# Altium project PCB_3U_SMA.PrjPCB
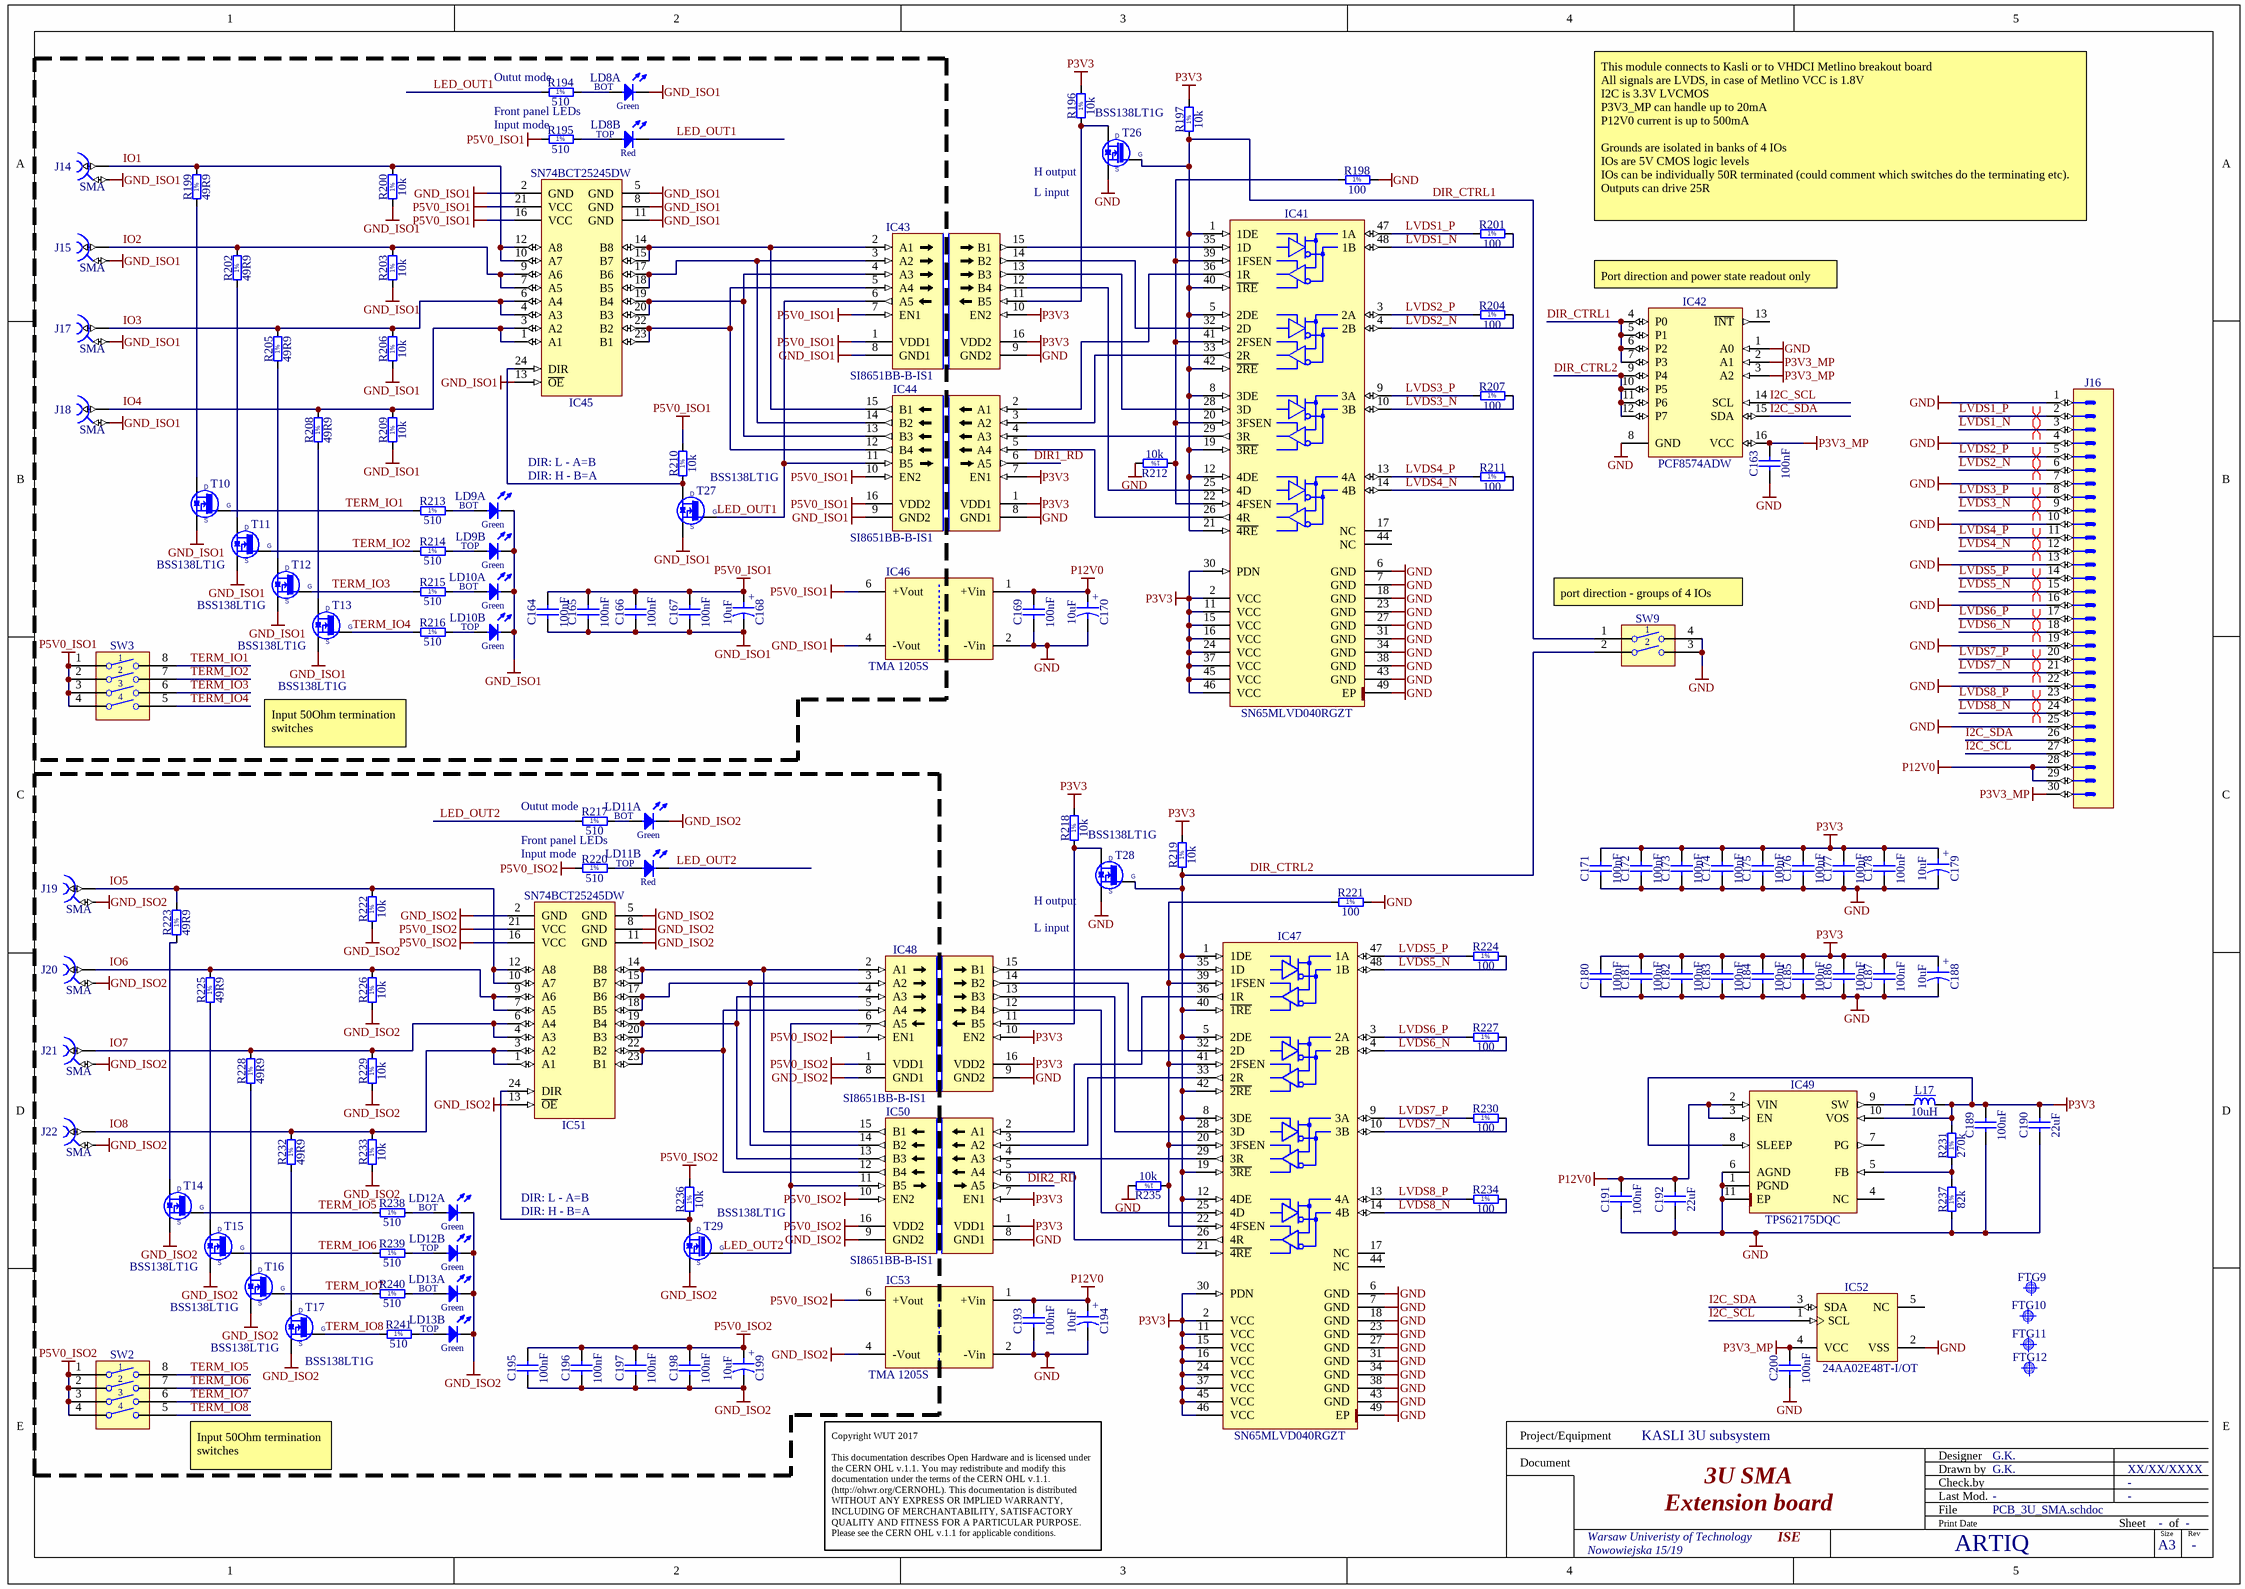
[diagram p0: PCB_3U_SMA.schdoc]
1 sheet, 134 parts. Net scope: global (net labels, ports and power ports of the same name join across sheets).
Board file: PCB_3U_SMA.PCBDOC

## Sheet PCB_3U_SMA.schdoc: 3U SMA
size 420 x 297 mm; Author: G.K.; CompanyName: WUT; DrawnBy: G.K.; Organization: WUT ISE; Address1: Warsaw Univeristy of Technology; Address2: Nowowiejska 15/19; Revision: -; SheetNumber: -; SheetTotal: -; EDA_Number: ARTIQ; Projet: KASLI 3U subsystem; ModifiedBy: -; CreateDate: XX/XX/XXXX; CheckedDate: -; Title2: Extension board; DivGrp: ISE; Designer: G.K.; ModifiedDate: -; ProjectName: KASLI 3U subsystem

### Parts
C163  100nF  [CAPC1005X55N]
C164  100nF  [CAPC1005X55N]
C165  100nF  [CAPC1005X55N]
C166  100nF  [CAPC1005X55N]
C167  100nF  [CAPC1005X55N]
C168  10uF  [CAPAE430X540N]
C169  100nF  [CAPC1005X55N]
C170  10uF  [CAPAE430X540N]
C171  100nF  [CAPC1005X55N]
C172  100nF  [CAPC1005X55N]
C173  100nF  [CAPC1005X55N]
C174  100nF  [CAPC1005X55N]
C175  100nF  [CAPC1005X55N]
C176  100nF  [CAPC1005X55N]
C177  100nF  [CAPC1005X55N]
C178  100nF  [CAPC1005X55N]
C179  10uF  [CAPAE430X540N]
C180  100nF  [CAPC1005X55N]
C181  100nF  [CAPC1005X55N]
C182  100nF  [CAPC1005X55N]
C183  100nF  [CAPC1005X55N]
C184  100nF  [CAPC1005X55N]
C185  100nF  [CAPC1005X55N]
C186  100nF  [CAPC1005X55N]
C187  100nF  [CAPC1005X55N]
C188  10uF  [CAPAE430X540N]
C189  100nF  [CAPC1005X55N]
C190  22uF  [CAPC2012X135N]
C191  100nF  [CAPC1005X55N]
C192  22uF  [CAPC2012X135N]
C193  100nF  [CAPC1005X55N]
C194  10uF  [CAPAE430X540N]
C195  100nF  [CAPC1005X55N]
C196  100nF  [CAPC1005X55N]
C197  100nF  [CAPC1005X55N]
C198  100nF  [CAPC1005X55N]
C199  10uF  [CAPAE430X540N]
C200  100nF  [CAPC1005X55N]
FTG9  Use only in PCB  [FIDUCIAL_TOP_C100-200]  (value not drawn)
FTG10  Use only in PCB  [FIDUCIAL_TOP_S100-200]  (value not drawn)
FTG11  Use only in PCB  [FIDUCIAL_TOP_S200-400]  (value not drawn)
FTG12  Use only in PCB  [FIDUCIAL_TOP_S100-200]  (value not drawn)
IC41  SN65MLVD040RGZT  [QFN50P700X700X100-49N-S420]
IC42  PCF8574ADW  [SOIC127P1030X265-16N]
IC43  SI8651BB-B-IS1  [SOIC127P600X175-16N]
IC44  SI8651BB-B-IS1  [SOIC127P600X175-16N]
IC45  SN74BCT25245DW  [SOIC127P1030X265-24N]
IC46  TMA 1205S  [DCDC_TRACO_TMA]
IC47  SN65MLVD040RGZT  [QFN50P700X700X100-49N-S420]
IC48  SI8651BB-B-IS1  [SOIC127P600X175-16N]
IC49  TPS62175DQC  [SON50P200X300X80-11N-R94X250]
IC50  SI8651BB-B-IS1  [SOIC127P600X175-16N]
IC51  SN74BCT25245DW  [SOIC127P1030X265-24N]
IC52  24AA02E48T-I/OT  [SOT95P280X145-5N]
IC53  TMA 1205S  [DCDC_TRACO_TMA]
J14  SMA  [MOLEX_73251-2120]
J15  SMA  [SMA209F]
J16  (no value)  [3M_N2530-6002RB]
J17  SMA  [MOLEX_73251-2120]
J18  SMA  [SMA209F]
J19  SMA  [MOLEX_73251-2120]
J20  SMA  [SMA209F]
J21  SMA  [MOLEX_73251-2120]
J22  SMA  [SMA209F]
L17  10uH  [IND_MURATA-PS_8400]
LD8  Red/Green  [LED_DIALIGHT_571-0112F]  (value not drawn)  (parts A,B of 2)
LD9  Green/Green  [LED_DIALIGHT_571-0122F]  (value not drawn)  (parts A,B of 2)
LD10  Green/Green  [LED_DIALIGHT_571-0122F]  (value not drawn)  (parts A,B of 2)
LD11  Red/Green  [LED_DIALIGHT_571-0112F]  (value not drawn)  (parts A,B of 2)
LD12  Green/Green  [LED_DIALIGHT_571-0122F]  (value not drawn)  (parts A,B of 2)
LD13  Green/Green  [LED_DIALIGHT_571-0122F]  (value not drawn)  (parts A,B of 2)
R194  510  [RESC1005X40N]
R195  510  [RESC1005X40N]
R196  10k  [RESC1005X40N]
R197  10k  [RESC1005X40N]
R198  100  [RESC1005X40N]
R199  49R9  [RESC3225X70N]
R200  10k  [RESC1005X40N]
R201  100  [RESC1005X40N]
R202  49R9  [RESC3225X70N]
R203  10k  [RESC1005X40N]
R204  100  [RESC1005X40N]
R205  49R9  [RESC3225X70N]
R206  10k  [RESC1005X40N]
R207  100  [RESC1005X40N]
R208  49R9  [RESC3225X70N]
R209  10k  [RESC1005X40N]
R210  10k  [RESC1005X40N]
R211  100  [RESC1005X40N]
R212  10k  [RESC1005X40N]
R213  510  [RESC1005X40N]
R214  510  [RESC1005X40N]
R215  510  [RESC1005X40N]
R216  510  [RESC1005X40N]
R217  510  [RESC1005X40N]
R218  10k  [RESC1005X40N]
R219  10k  [RESC1005X40N]
R220  510  [RESC1005X40N]
R221  100  [RESC1005X40N]
R222  10k  [RESC1005X40N]
R223  49R9  [RESC3225X70N]
R224  100  [RESC1005X40N]
R225  49R9  [RESC3225X70N]
R226  10k  [RESC1005X40N]
R227  100  [RESC1005X40N]
R228  49R9  [RESC3225X70N]
R229  10k  [RESC1005X40N]
R230  100  [RESC1005X40N]
R231  270k  [RESC1608X55N]
R232  49R9  [RESC3225X70N]
R233  10k  [RESC1005X40N]
R234  100  [RESC1005X40N]
R235  10k  [RESC1005X40N]
R236  10k  [RESC1005X40N]
R237  82k  [RESC1608X55N]
R238  510  [RESC1005X40N]
R239  510  [RESC1005X40N]
R240  510  [RESC1005X40N]
R241  510  [RESC1005X40N]
SW2  Switch  [SW_OMRON_A6S-4102-H]  (value not drawn)
SW3  Switch  [SW_OMRON_A6S-4102-H]  (value not drawn)
SW9  Switch  [SW_OMRON_A6S-2102-H]  (value not drawn)
T10  BSS138LT1G  [SOT95P240X110-3N]
T11  BSS138LT1G  [SOT95P240X110-3N]
T12  BSS138LT1G  [SOT95P240X110-3N]
T13  BSS138LT1G  [SOT95P240X110-3N]
T14  BSS138LT1G  [SOT95P240X110-3N]
T15  BSS138LT1G  [SOT95P240X110-3N]
T16  BSS138LT1G  [SOT95P240X110-3N]
T17  BSS138LT1G  [SOT95P240X110-3N]
T26  BSS138LT1G  [SOT95P240X110-3N]
T27  BSS138LT1G  [SOT95P240X110-3N]
T28  BSS138LT1G  [SOT95P240X110-3N]
T29  BSS138LT1G  [SOT95P240X110-3N]

### Nets
GND: C163.1 C169.1 C170.2 C171.1 C172.1 C173.1 C174.1 C175.1 C176.1 C177.1 C178.1 C179.2 C180.1 C181.1 C182.1 C183.1 C184.1 C185.1 C186.1 C187.1 C188.2 C189.1 C190.1 C191.1 C192.1 C193.1 C194.2 C200.1 IC41.6(GND) IC41.7(GND) IC41.18(GND) IC41.23(GND) IC41.27(GND) IC41.31(GND) IC41.34(GND) IC41.38(GND) IC41.43(GND) IC41.49(EP) IC42.1(A0) IC42.8(GND) IC43.9(GND2) IC44.8(GND1) IC46.2(-Vin) IC47.6(GND) IC47.7(GND) IC47.18(GND) IC47.23(GND) IC47.27(GND) IC47.31(GND) IC47.34(GND) IC47.38(GND) IC47.43(GND) IC47.49(EP) IC48.9(GND2) IC49.1(PGND) IC49.6(AGND) IC49.11(EP) IC50.8(GND1) IC52.2(VSS) IC53.2(-Vin) J16.1 J16.4 J16.7 J16.10 J16.13 J16.16 J16.19 J16.22 J16.25 R198.2 R212.2 R221.2 R235.2 R237.1 SW9.3 SW9.4 T26.2(S) T28.2(S)
GND_ISO1: C164.1 C165.1 C166.1 C167.1 C168.2 IC43.8(GND1) IC44.9(GND2) IC45.2(GND) IC45.5(GND) IC45.8(GND) IC45.11(GND) IC45.13(~{OE}) IC46.4(-Vout) J14.2 J15.2 J17.2 J18.2 LD8.1(C) LD9.1(C) LD9.3(C) LD10.1(C) LD10.3(C) R200.1 R203.1 R206.1 R209.1 T10.2(S) T11.2(S) T12.2(S) T13.2(S) T27.2(S)
GND_ISO2: C195.1 C196.1 C197.1 C198.1 C199.2 IC48.8(GND1) IC50.9(GND2) IC51.2(GND) IC51.5(GND) IC51.8(GND) IC51.11(GND) IC51.13(~{OE}) IC53.4(-Vout) J19.2 J20.2 J21.2 J22.2 LD11.1(C) LD12.1(C) LD12.3(C) LD13.1(C) LD13.3(C) R222.1 R226.1 R229.1 R233.1 T14.2(S) T15.2(S) T16.2(S) T17.2(S) T29.2(S)
P3V3: C171.2 C172.2 C173.2 C174.2 C175.2 C176.2 C177.2 C178.2 C179.1 C180.2 C181.2 C182.2 C183.2 C184.2 C185.2 C186.2 C187.2 C188.1 C189.2 C190.2 IC41.2(VCC) IC41.11(VCC) IC41.15(VCC) IC41.16(VCC) IC41.24(VCC) IC41.30(PDN) IC41.37(VCC) IC41.45(VCC) IC41.46(VCC) IC43.10(EN2) IC43.16(VDD2) IC44.1(VDD1) IC44.7(EN1) IC47.2(VCC) IC47.11(VCC) IC47.15(VCC) IC47.16(VCC) IC47.24(VCC) IC47.30(PDN) IC47.37(VCC) IC47.45(VCC) IC47.46(VCC) IC48.10(EN2) IC48.16(VDD2) IC49.8(SLEEP) IC49.10(VOS) IC50.1(VDD1) IC50.7(EN1) L17.2 R196.2 R197.2 R218.2 R219.2 R231.2
P3V3_MP: C163.2 C200.2 IC42.2(A1) IC42.3(A2) IC42.16(VCC) IC52.4(VCC) J16.30
P5V0_ISO1: C164.2 C165.2 C166.2 C167.2 C168.1 IC43.1(VDD1) IC43.7(EN1) IC44.10(EN2) IC44.16(VDD2) IC45.16(VCC) IC45.21(VCC) IC46.6(+Vout) R195.1 R210.2 SW3.1 SW3.2 SW3.3 SW3.4
P5V0_ISO2: C195.2 C196.2 C197.2 C198.2 C199.1 IC48.1(VDD1) IC48.7(EN1) IC50.10(EN2) IC50.16(VDD2) IC51.16(VCC) IC51.21(VCC) IC53.6(+Vout) R220.1 R236.2 SW2.1 SW2.2 SW2.3 SW2.4
P12V0: C169.2 C170.1 C191.2 C192.2 C193.2 C194.1 IC46.1(+Vin) IC49.2(VIN) IC49.3(EN) IC53.1(+Vin) J16.28 J16.29
DIR1_RD: IC44.6(A5)
DIR2_RD: IC50.6(A5)
DIR_CTRL1: IC41.1(1DE) IC41.5(2DE) IC41.8(3DE) IC41.12(4DE) IC41.19(~{3RE}) IC41.21(~{4RE}) IC41.40(~{1RE}) IC41.42(~{2RE}) IC42.4(P0) IC42.5(P1) IC42.6(P2) IC42.7(P3) R197.1 SW9.1 T26.1(G)
DIR_CTRL2: IC42.9(P4) IC42.10(P5) IC42.11(P6) IC42.12(P7) IC47.1(1DE) IC47.5(2DE) IC47.8(3DE) IC47.12(4DE) IC47.19(~{3RE}) IC47.21(~{4RE}) IC47.40(~{1RE}) IC47.42(~{2RE}) R219.1 SW9.2 T28.1(G)
I2C_SCL: IC42.14(SCL) IC52.1(SCL) J16.27
I2C_SDA: IC42.15(SDA) IC52.3(SDA) J16.26
IO1: IC45.10(A7) IC45.12(A8) J14.1 R199.2 R200.2
IO2: IC45.7(A5) IC45.9(A6) J15.1 R202.2 R203.2
IO3: IC45.4(A3) IC45.6(A4) J17.1 R205.2 R206.2
IO4: IC45.1(A1) IC45.3(A2) J18.1 R208.2 R209.2
IO5: IC51.10(A7) IC51.12(A8) J19.1 R222.2 R223.2
IO6: IC51.7(A5) IC51.9(A6) J20.1 R225.2 R226.2
IO7: IC51.4(A3) IC51.6(A4) J21.1 R228.2 R229.2
IO8: IC51.1(A1) IC51.3(A2) J22.1 R232.2 R233.2
LED_OUT1: IC43.6(A5) IC44.11(B5) LD8.3(C) R194.1 T27.1(G)
LED_OUT2: IC48.6(A5) IC50.11(B5) LD11.3(C) R217.1 T29.1(G)
LVDS1_N: IC41.48(1B) J16.3 R201.2
LVDS1_P: IC41.47(1A) J16.2 R201.1
LVDS2_N: IC41.4(2B) J16.6 R204.2
LVDS2_P: IC41.3(2A) J16.5 R204.1
LVDS3_N: IC41.10(3B) J16.9 R207.2
LVDS3_P: IC41.9(3A) J16.8 R207.1
LVDS4_N: IC41.14(4B) J16.12 R211.2
LVDS4_P: IC41.13(4A) J16.11 R211.1
LVDS5_N: IC47.48(1B) J16.15 R224.2
LVDS5_P: IC47.47(1A) J16.14 R224.1
LVDS6_N: IC47.4(2B) J16.18 R227.2
LVDS6_P: IC47.3(2A) J16.17 R227.1
LVDS7_N: IC47.10(3B) J16.21 R230.2
LVDS7_P: IC47.9(3A) J16.20 R230.1
LVDS8_N: IC47.14(4B) J16.24 R234.2
LVDS8_P: IC47.13(4A) J16.23 R234.1
TERM_IO1: R213.1 SW3.8 T10.1(G)
TERM_IO2: R214.1 SW3.7 T11.1(G)
TERM_IO3: R215.1 SW3.6 T12.1(G)
TERM_IO4: R216.1 SW3.5 T13.1(G)
TERM_IO5: R238.1 SW2.8 T14.1(G)
TERM_IO6: R239.1 SW2.7 T15.1(G)
TERM_IO7: R240.1 SW2.6 T16.1(G)
TERM_IO8: R241.1 SW2.5 T17.1(G)
NetIC41_20: IC41.20(3FSEN) IC41.22(4FSEN) IC41.39(1FSEN) IC41.41(2FSEN) R198.1 R212.1
NetIC41_25: IC41.25(4D) IC43.12(B4)
NetIC41_26: IC41.26(4R) IC44.5(A4)
NetIC41_28: IC41.28(3D) IC43.13(B3)
NetIC41_29: IC41.29(3R) IC44.4(A3)
NetIC41_32: IC41.32(2D) IC43.14(B2)
NetIC41_33: IC41.33(2R) IC44.3(A2)
NetIC41_35: IC41.35(1D) IC43.15(B1)
NetIC41_36: IC41.36(1R) IC44.2(A1)
NetIC43_2: IC43.2(A1) IC44.15(B1) IC45.14(B8) IC45.15(B7)
NetIC43_3: IC43.3(A2) IC44.14(B2) IC45.17(B6) IC45.18(B5)
NetIC43_4: IC43.4(A3) IC44.13(B3) IC45.19(B4) IC45.20(B3)
NetIC43_5: IC43.5(A4) IC44.12(B4) IC45.22(B2) IC45.23(B1)
NetIC43_11: IC43.11(B5) R196.1 T26.3(D)
NetIC45_24: IC45.24(DIR) R210.1 T27.3(D)
NetIC47_20: IC47.20(3FSEN) IC47.22(4FSEN) IC47.39(1FSEN) IC47.41(2FSEN) R221.1 R235.1
NetIC47_25: IC47.25(4D) IC48.12(B4)
NetIC47_26: IC47.26(4R) IC50.5(A4)
NetIC47_28: IC47.28(3D) IC48.13(B3)
NetIC47_29: IC47.29(3R) IC50.4(A3)
NetIC47_32: IC47.32(2D) IC48.14(B2)
NetIC47_33: IC47.33(2R) IC50.3(A2)
NetIC47_35: IC47.35(1D) IC48.15(B1)
NetIC47_36: IC47.36(1R) IC50.2(A1)
NetIC48_2: IC48.2(A1) IC50.15(B1) IC51.14(B8) IC51.15(B7)
NetIC48_3: IC48.3(A2) IC50.14(B2) IC51.17(B6) IC51.18(B5)
NetIC48_4: IC48.4(A3) IC50.13(B3) IC51.19(B4) IC51.20(B3)
NetIC48_5: IC48.5(A4) IC50.12(B4) IC51.22(B2) IC51.23(B1)
NetIC48_11: IC48.11(B5) R218.1 T28.3(D)
NetIC49_5: IC49.5(FB) R231.1 R237.2
NetIC49_9: IC49.9(SW) L17.1
NetIC51_24: IC51.24(DIR) R236.1 T29.3(D)
NetLD8_2: LD8.2(A) R194.2
NetLD8_4: LD8.4(A) R195.2
NetLD9_2: LD9.2(A) R213.2
NetLD9_4: LD9.4(A) R214.2
NetLD10_2: LD10.2(A) R215.2
NetLD10_4: LD10.4(A) R216.2
NetLD11_2: LD11.2(A) R217.2
NetLD11_4: LD11.4(A) R220.2
NetLD12_2: LD12.2(A) R238.2
NetLD12_4: LD12.4(A) R239.2
NetLD13_2: LD13.2(A) R240.2
NetLD13_4: LD13.4(A) R241.2
NetR199_1: R199.1 T10.3(D)
NetR202_1: R202.1 T11.3(D)
NetR205_1: R205.1 T12.3(D)
NetR208_1: R208.1 T13.3(D)
NetR223_1: R223.1 T14.3(D)
NetR225_1: R225.1 T15.3(D)
NetR228_1: R228.1 T16.3(D)
NetR232_1: R232.1 T17.3(D)

Not connected (* = marked no-connect by the designer): IC41 17(NC) 44(NC); IC42 13(~{INT}); IC47 17(NC) 44(NC); IC49 4(NC) 7(PG); IC52 5(NC)

### Layout directives
differential pair: LVDS1_N, LVDS1_P, LVDS2_N, LVDS2_P, LVDS3_N, LVDS3_P, LVDS4_N, LVDS4_P, LVDS5_N, LVDS5_P, LVDS6_N, LVDS6_P, LVDS7_N, LVDS7_P, LVDS8_N, LVDS8_P

### Notes on the sheet
- (near R195) Input mode
- (near R194) Outut mode
- Front panel LEDs
- (near T26) H output
- L input
- This module connects to Kasli or to VHDCI Metlino breakout board
  All signals are LVDS, in case of Metlino VCC is 1.8V
  I2C is 3.3V LVCMOS
  P3V3_MP can handle up to 20mA
  P12V0 current is up to 500mA
  Grounds are isolated in banks of 4 IOs
  IOs are 5V CMOS logic levels
  IOs can be individually 50R terminated (could comment which switches do the terminating etc).
  Outputs can drive 25R
- (near IC42) Port direction and power state readout only
- DIR: L - A=B
- (near LD9) DIR: H - B=A
- (near SW9) port direction - groups of 4 IOs
- Input 50Ohm termination switches
- (near R220) Input mode
- (near R217) Outut mode
- (near T28) H output
- DIR: H - B=A
- (near SW2) Input 50Ohm termination switches
- Copyright WUT 2017
  This documentation describes Open Hardware and is licensed under the CERN OHL v.1.1. You may redistribute and modify this documentation under the terms of the CERN OHL v.1.1. (http://ohwr.org/CERNOHL). This documentation is distributed WITHOUT ANY EXPRESS OR IMPLIED WARRANTY, INCLUDING OF MERCHANTABILITY, SATISFACTORY QUALITY AND FITNESS FOR A PARTICULAR PURPOSE. Please see the CERN OHL v.1.1 for applicable conditions.
- Project/Equipment
- Document
- Designer
- Drawn by
- Check.by
- File
- Last Mod.
- Print Date
- Sheet
- Size
- A3
- of
- Rev
- (in symbol CAE430-540_10UF_16V_20%) +
- (in symbol LED_DIALIGHT_571-0112F, part A) BOT; Green
- (in symbol LED_DIALIGHT_571-0112F, part B) TOP; Red
- (in symbol LED_DIALIGHT_571-0122F, part A) BOT; Green
- (in symbol LED_DIALIGHT_571-0122F, part B) TOP; Green
- (in symbol R0402_10K_1%_0.0625W_100PPM) 1%
- (in symbol R0402_100R_1%_0.1W_100PPM) 1%
- (in symbol R0402_510R_1%_0.0625W_100PPM) 1%
- (in symbol R0603_82K_1%_0.1W_100PPM) 1%
- (in symbol R0603_270K_1%_0.1W_100PPM) 1%
- (in symbol R1210_49R9_1%_0.5W_100PPM_VISHAY_CRCW) 1%

### Library data of the parts
C163-C167 C169 C171-C178 C180-C187 C189 C191 C193 C195-C198 C200 = CC0402_100NF_16V_10%_X5R: Non-polarised capacitor; Part Description: SMD Multilayer Chip Ceramic Capacitor; Manufacturer: GENERIC; Manufacturer1 Part Number: GRM155R61C104KA88D; Voltage: 16V; TC: X5R; Tolerance: ±10%; Part Number: CC0402_100NF_16V_10%_X5R; Component Kind: Standard; Component Type: Standard; Pin Count: 2; Value: 100nF; Status: None; Manufacturer Part Number: CC0402_100NF_16V_10%_X5R; Case: 0402; Mounted: Yes; Socket: No; SMD: Yes; Sense: No; Manufacturer1 Example: MURATA; Manufacturer1 ComponentHeight: 0.55mm; HelpURL: \\cern.ch\dfs\Applications\Altium\Datasheets\CC0402_X5R_MURATA_GRM.pdf; Author: CERN DEM JLC; CreateDate: 10.12.2013; LatestRevisionDate: 10.12.2013
C168 C170 C179 C188 C194 C199 = CAE430-540_10UF_16V_20%: Polarised capacitor; Part Description: Aluminum Electrolytic SMT Capacitor; Manufacturer: PANASONIC; Manufacturer Part Number: EEEFK1C100AR; Voltage: 16V; Tolerance: ±20%; Part Number: CAE430-540_10UF_16V_20%; Component Kind: Standard; Component Type: Standard; Pin Count: 2; Value: 10uF; Status: Not Recommended; Case: B; Mounted: Yes; Socket: No; SMD: Yes; Sense: No; ComponentHeight: 5.8mm; HelpURL: \\cern.ch\dfs\Applications\Altium\Datasheets\CAE_PANASONIC_FK.pdf; Author: CERN DEM JLC; CreateDate: 03.12.2007; LatestRevisionDate: 05.11.2014
C190 C192 = CC0805_22UF_16V_10%_X5R: Non-polarised capacitor; Part Description: SMD Multilayer Chip Ceramic Capacitor; Manufacturer: GENERIC; Manufacturer1 Part Number: C2012X5R1C226KT; Voltage: 16V; TC: X5R; Tolerance: ±10%; Part Number: CC0805_22UF_16V_10%_X5R; Component Kind: Standard; Component Type: Standard; Pin Count: 2; Value: 22uF; Status: Preferred; Manufacturer Part Number: CC0805_22UF_16V_10%_X5R; Case: 0805; Mounted: Yes; Socket: No; SMD: Yes; Sense: No; Manufacturer1 Example: TDK; Manufacturer1 ComponentHeight: 1.35mm; HelpURL: \\cern.ch\dfs\Applications\Altium\Datasheets\CC0805_X5R_TDK_C.pdf; Author: CERN DEM JLC; CreateDate: 25.10.2012; LatestRevisionDate: 25.10.2012
FTG9 = FIDUCIAL_TARGET_C100-200: Fiducial Target; Part Description: Round Fiducial Target, Top Layer, 1.0mm, Top Solder 2.0mm, Keepout =2.0mm; Mounted: No; Part Number: FIDUCIAL_TARGET_C100-200; Component Kind: Standard (No BOM); Component Type: Standard (No BOM); Pin Count: 1; Family: Fiducial; Socket: No; SMD: Yes; Sense: No; Status: None; ComponentHeight: 0mm; HelpURL: Undefined; Author: CERN DEM JLC; CreateDate: 09.02.2010; LatestRevisionDate: 04.04.2012; PackageDescription: Round Fiducial Target, Top Layer, 1.0mm, Top Solder 2.0mm, Keepout =2.0mm
FTG10 FTG12 = FIDUCIAL_TARGET_S100-200: Fiducial Target; Part Description: Square Fiducial Target, Top Layer, 1.0mm, Top Solder 2.0mm, Keepout =2.0mm; Mounted: No; Part Number: FIDUCIAL_TARGET_S100-200; Component Kind: Standard (No BOM); Component Type: Standard (No BOM); Pin Count: 1; Family: Fiducial; Socket: No; SMD: Yes; Sense: No; Status: None; ComponentHeight: 0mm; HelpURL: Undefined; Author: CERN DEM JLC; CreateDate: 09.02.2010; LatestRevisionDate: 04.04.2012; PackageDescription: Square Fiducial Target, Top Layer, 1.0mm, Top Solder 2.0mm, Keepout =2.0mm
FTG11 = FIDUCIAL_TARGET_S200-400: Fiducial Target; Part Description: Square Fiducial Target, Top Layer, 2.0mm, Top Solder 4.0mm, Keepout =4.0mm; Mounted: No; Part Number: FIDUCIAL_TARGET_S200-400; Component Kind: Standard (No BOM); Component Type: Standard (No BOM); Pin Count: 1; Family: Fiducial; Socket: No; SMD: Yes; Sense: No; Status: None; ComponentHeight: 0mm; HelpURL: Undefined; Author: CERN DEM JLC; CreateDate: 02.06.2008; LatestRevisionDate: 04.04.2012; PackageDescription: Square Fiducial Target, Top Layer, 2.0mm, Top Solder 4.0mm, Keepout =4.0mm
IC41 IC47 = SN65MLVD040RGZT: 4-Channel Half-Duplex M-LVDS Line Transceiver; Manufacturer: TEXAS INSTRUMENTS; PressFit: No; Bonding: No; Part Number: SN65MLVD040RGZT; Component Kind: Standard; Component Type: Standard; Device: SN65MLVD040RGZT; PackageDescription: QFN, 0.50mm Pitch, Square; 48 Pin, 7.00mm L X 7.00mm W X 1mm H body (W/Thermal Tab 4.2mm X 4.2mm), IPC Medium Density; Part Description: 4-Channel Half-Duplex M-LVDS Line Transceiver; Manufacturer Part Number: SN65MLVD040RGZT; Pin Count: 49; Case: QFN48; Mounted: Yes; Socket: No; SMD: Yes; Sense: No; ComponentHeight: 1mm; Author: CERN DEM JLC; HelpURL: \\cern.ch\dfs\Applications\Altium\Datasheets\SN65MLVD040RGZT.pdf; CreateDate: 17.03.2011; LatestRevisionDate: 17.03.2011
IC42 = PCF8574ADW: Remote 8-bit I/O Expander For I2C Bus; Manufacturer: TEXAS INSTRUMENTS; PressFit: No; Bonding: No; Part Number: PCF8574ADW; Component Kind: Standard; Component Type: Standard; Device: PCF8574ADW; PackageDescription: SOIC 16, Pitch 1.27mm - Body 7.5x10.3mm, IPC Medium Density; Part Description: Remote 8-bit I/O Expander For I2C Bus; Manufacturer Part Number: PCF8574ADW; Pin Count: 16; Case: SOIC16W; Mounted: Yes; Socket: No; SMD: Yes; Sense: No; ComponentHeight: 2.65mm; Author: CERN DEM JLC; HelpURL: \\cern.ch\dfs\Applications\Altium\Datasheets\PCF8574ADW.pdf; CreateDate: 01.11.2012; LatestRevisionDate: 01.11.2012
IC43 IC44 IC48 IC50 = SI8651BB-B-IS1: Low Power Five-Channel Digital Isolator; Part Description: 2.5kV 150Mbps Low Power Five-Channel Digital Isolator; Manufacturer: SILICON LABS; PressFit: No; Bonding: No; Part Number: SI8651BB-B-IS1; Component Kind: Standard; Component Type: Standard; Device: SI8651BB-B-IS1; PackageDescription: SOIC 16, Pitch 1.27mm - Body 4x10mm, IPC Medium Density; Manufacturer Part Number: SI8651BB-B-IS1; Pin Count: 16; Case: SOIC16; Mounted: Yes; Socket: No; SMD: Yes; Sense: No; ComponentHeight: 1.75mm; Author: CERN DEM JLC; HelpURL: \\cern.ch\dfs\Applications\Altium\Datasheets\SI8651BB-B-IS1.pdf; CreateDate: 31.10.2013; LatestRevisionDate: 31.10.2013
IC45 IC51 = SN74BCT25245DW: 25 Ohms Octal Bus Transceiver With 3-State Outputs; Manufacturer: TEXAS INSTRUMENTS; PressFit: No; Bonding: No; Part Number: SN74BCT25245DW; Component Kind: Standard; Component Type: Standard; Device: SN74BCT25245DW; PackageDescription: SOIC 24, Pitch 1.27mm - Body 7.6x15.6mm, IPC Medium Density; Part Description: 25 Ohms Octal Bus Transceiver With 3-State Outputs; Manufacturer Part Number: SN74BCT25245DW; Pin Count: 24; Case: SOIC24; Mounted: Yes; Socket: No; SMD: Yes; Sense: No; ComponentHeight: 2.65mm; Author: CERN DEM JLC; HelpURL: \\cern.ch\dfs\Applications\Altium\Datasheets\SN74BCT25245DW.pdf; CreateDate: 09.11.2009; LatestRevisionDate: 09.11.2009
IC46 IC53 = DC/DC_TRACO_TMA1205S: 1 W Watt, 10.8-13.2VDCVin, 5 V@0.2 A; Part Description: 12V ±10% to 5V, Iout (max) 200mA, 1W DC-DC Converter; Manufacturer: TRACO POWER; PressFit: No; Bonding: No; Part Number: TMA 1205S; Component Kind: Standard; Component Type: Standard; Device: TMA 1205S; PackageDescription: TMA Series, Body 19.5x6.1mm, SIP-6, Unregulated; Manufacturer Part Number: TMA 1205S; Pin Count: 4; Mounted: Yes; Socket: No; SMD: No; Sense: No; ComponentHeight: 10.45mm; HelpURL: \\cern.ch\dfs\Applications\Altium\Datasheets\TMA 0505S.pdf; Author: GK; CreateDate: 17.12.2016; LatestRevisionDate: 17.12.2016
IC49 = TPS62175DQC: 4.75-28VDC to 1-6VDC, 500mA Step-Down Converter With Sleep Mode; Manufacturer: TEXAS INSTRUMENTS; PressFit: No; Bonding: No; Part Number: TPS62175DQC; Component Kind: Standard; Component Type: Standard; Device: TPS62175DQC; PackageDescription: SON, 10-Leads, Body 2x3mm, Pitch 0.5mm, Thermal Pad 0.94x2.5mm, IPC Medium Density; Part Description: 4.75-28VDC to 1-6VDC, 500mA Step-Down Converter With Sleep Mode; Manufacturer Part Number: TPS62175DQC; Pin Count: 11; Case: SON10; Mounted: Yes; Socket: No; SMD: Yes; Sense: No; ComponentHeight: 0.8mm; HelpURL: \\cern.ch\dfs\Applications\Altium\Datasheets\TPS62175DQC.pdf; Author: CERN DEM JMW; CreateDate: 11.08.2015; LatestRevisionDate: 11.08.2015
IC52 = 24AA02E48T-I/OT: 1.7V-5.5V, 2K I2C Serial EEPROM With EUI-48 Node Identity; Manufacturer: MICROCHIP TECHNOLOGY; PressFit: No; Bonding: No; Part Number: 24AA02E48T-I/OT; Component Kind: Standard; Component Type: Standard; Device: 24AA02E48T-I/OT; PackageDescription: SOT, 0.95mm pitch; 5 pin, 1.60mm W X 2.90mm L X 1.45mm H body, IPC Medium Density; Part Description: 1.7V-5.5V, 2K I2C Serial EEPROM With EUI-48 Node Identity; Manufacturer Part Number: 24AA02E48T-I/OT; Pin Count: 5; Case: SOT23-5; Mounted: Yes; Socket: No; SMD: Yes; Sense: No; ComponentHeight: 1.45mm; HelpURL: \\cern.ch\dfs\Applications\Altium\Datasheets\24AA02E48T-I-OT.pdf; Author: CERN DEM MR; CreateDate: 31.03.2016; LatestRevisionDate: 31.03.2016
J14 J17 J19 J21 = CON_SMA_RA_SMD_73251-2120: 50 Ohm, SMA Edge Mount PCB, With Jam Nut And Lock Washer; Manufacturer: MOLEX; PressFit: No; Part Number: MOLEX_73251-2120; Component Kind: Standard; Component Type: Standard; Pin Count: 5; Family: SMA; Mounted: Yes; Socket: No; SMD: Yes; Sense: No; Status: None; Part Description: 50 Ohm, SMA Edge Mount PCB, With Jam Nut And Lock Washer; Manufacturer Part Number: 73251-2120; ComponentHeight: 5.75mm; HelpURL: \\cern.ch\dfs\Applications\Altium\Datasheets\MOLEX_73251-2121.pdf; Author: CERN DEM JLC; CreateDate: 26.10.2016; LatestRevisionDate: 26.10.2016
J15 J18 J20 J22 = CON_SMA_SMA209F: 50 Ohm Through Hole SMA Right Angle PCB Jack; Manufacturer: S-Conn; Manufacturer Part Number: S209F4G02-1; PressFit: No; Part Number: SMA209F; Component Kind: Standard; Component Type: Standard; Pin Count: 5; Family: SMA; Mounted: Yes; Socket: No; SMD: No; Sense: No; Status: None; Part Description: 50 Ohm Through Hole SMA Right Angle PCB Jack; ComponentHeight: 10.44mm; HelpURL: \\cern.ch\dfs\Applications\Altium\Datasheets\AMPHENOL_132203.pdf; Author: GK; CreateDate: 06.10.2016; LatestRevisionDate: 06.10.2016
J16 = 3M_N2530-6002RB: Connector 30 Male; Part Description: 30 Contacts - Straight .100'' x .100'' Low Profile Four-Wall Header, 2500 Series; Manufacturer: 3M; PressFit: No; Part Number: 3M_N2530-6002RB; Component Kind: Standard; Component Type: Standard; Pin Count: 30; Family: Header 30; Mounted: Yes; Socket: No; SMD: No; Sense: No; Status: None; Manufacturer Part Number: N2530-6002RB; ComponentHeight: 10.03mm; HelpURL: \\cern.ch\dfs\Applications\Altium\Datasheets\3M_N2530-6002RB.pdf; Author: CERN DEM JLC; CreateDate: 11.02.2009; LatestRevisionDate: 11.08.2009
L17 = IND_10UH_10%_MURATA-PS_8400: Inductor With Core; Part Description: Miniature Surface Mount Power Inductor (8400 Serie); Manufacturer: MURATA POWER SOLUTIONS; Manufacturer Part Number: 84103C; Power: 950mA; Resistance: 0.24R; Tolerance: ±10%; Part Number: IND_10UH_10%_MURATA-PS_8400; Component Kind: Standard; Component Type: Standard; Pin Count: 2; Value: 10uH; Status: None; Mounted: Yes; Socket: No; SMD: Yes; Sense: No; ComponentHeight: 2.9mm; HelpURL: \\cern.ch\dfs\Applications\Altium\Datasheets\IND_MURATA-PS_8400.pdf; Author: CERN DEM JLC; CreateDate: 02.07.2012; LatestRevisionDate: 02.07.2012
LD8 LD11 = LED_DIALIGHT_571-0112F: 2x LED  Botom Green, Top Red; Part Description: Dual 2mm  LEDs, Red Top,Green Bot, CBI® Circuit Board Indicator (Without positioning pins); PressFit: No; Bonding: No; Part Number: LED_DIALIGHT_571-0112F; Component Kind: Standard; Component Type: Standard; Color: Red/Green; PackageDescription: 2x 2mm LED (Top: Red, Bot: Green) PCB Edge Mounting (Without positioning pins) DIALIGHT 571 Serie; Manufacturer: DIALIGHT; Manufacturer Part Number: 571-0112F; Pin Count: 4; Mounted: Yes; Socket: No; SMD: No; Sense: No; ComponentHeight: 8.6mm; HelpURL: \\cern.ch\dfs\Applications\Altium\Datasheets\LED_DIALIGHT_571-0112F.pdf; Author: CERN DEM JLC; CreateDate: 09.11.2009; LatestRevisionDate: 17.03.2010
LD9 LD10 LD12 LD13 = LED_DIALIGHT_571-0122F: LED x2 Green 1C2A-BOT_3C4A-TOP; Part Description: Dual 2mm Green LEDs CBI® Circuit Board Indicator (Without positioning pins); PressFit: No; Bonding: No; Part Number: LED_DIALIGHT_571-0122F; Component Kind: Standard; Component Type: Standard; Color: Green/Green; PackageDescription: 2x 2mm Red LED PCB Edge Mounting (Without positioning pins) DIALIGHT 571 Serie; Manufacturer: DIALIGHT; Manufacturer Part Number: 571-0122F; Pin Count: 4; Mounted: Yes; Socket: No; SMD: No; Sense: No; ComponentHeight: 8.6mm; HelpURL: \\cern.ch\dfs\Applications\Altium\Datasheets\LED_DIALIGHT_571-0122F.pdf; Author: CERN DEM JLC; CreateDate: 09.11.2009; LatestRevisionDate: 17.03.2010
R194 R195 R213-R217 R220 R238-R241 = R0402_510R_1%_0.0625W_100PPM: Resistor - 1%; Part Description: General Purpose Thick Film Chip Resistor; Manufacturer: GENERIC; Manufacturer1 Part Number: 232270675101L; TC: ±100ppm/°C; Part Number: R0402_510R_1%_0.0625W_100PPM; Component Kind: Standard; Component Type: Standard; Pin Count: 2; Value: 510; Status: Not recommended; Power: 0.0625W; Tolerance: ±1%; Manufacturer Part Number: R0402_510R_1%_0.0625W_100PPM; Case: 0402; Mounted: Yes; Sense: No; Socket: No; SMD: Yes; Manufacturer1 Example: YAGEO PHYCOMP; Manufacturer1 ComponentHeight: 0.4mm; HelpURL: \\cern.ch\dfs\Applications\Altium\Datasheets\R0402_Phycomp_RC0402.pdf; Author: CERN DEM JLC; CreateDate: 03.12.2007; LatestRevisionDate: 17.10.2012
R196 R197 R200 R203 R206 R209 R210 R212 R218 R219 R222 R226 R229 R233 R235 R236 = R0402_10K_1%_0.0625W_100PPM: Resistor - 1%; Part Description: General Purpose Thick Film Chip Resistor; Manufacturer: GENERIC; Manufacturer1 Part Number: 232270671003L; TC: ±100ppm/°C; Part Number: R0402_10K_1%_0.0625W_100PPM; Component Kind: Standard; Component Type: Standard; Pin Count: 2; Value: 10k; Status: Not recommended; Power: 0.0625W; Tolerance: ±1%; Manufacturer Part Number: R0402_10K_1%_0.0625W_100PPM; Case: 0402; Mounted: Yes; Sense: No; Socket: No; SMD: Yes; Manufacturer1 Example: YAGEO PHYCOMP; Manufacturer1 ComponentHeight: 0.4mm; HelpURL: \\cern.ch\dfs\Applications\Altium\Datasheets\R0402_Phycomp_RC0402.pdf; Author: CERN DEM JLC; CreateDate: 03.12.2007; LatestRevisionDate: 17.10.2012
R198 R201 R204 R207 R211 R221 R224 R227 R230 R234 = R0402_100R_1%_0.1W_100PPM: Resistor - 1%; Part Description: General Purpose Thick Film Chip Resistor; Manufacturer: GENERIC; Manufacturer Part Number: R0402_100R_1%_0.1W_100PPM_50V; Manufacturer1 Part Number: ERJ2RKF1000X; Power: 0.1W; TC: ±100ppm/°C; Voltage: 50V; Part Number: R0402_100R_1%_0.1W_100PPM; Component Kind: Standard; Component Type: Standard; Pin Count: 2; Value: 100; Status: Not recommended; Tolerance: ±1%; Case: 0402; Mounted: Yes; Sense: No; Socket: No; SMD: Yes; Manufacturer1 Example: PANASONIC; Manufacturer1 ComponentHeight: 0.4mm; HelpURL: \\cern.ch\dfs\Applications\Altium\Datasheets\R0402_PANASONIC_ERJ2RK.pdf; Author: CERN DEM JLC; CreateDate: 12.12.2013; LatestRevisionDate: 03.03.2015
R199 R202 R205 R208 R223 R225 R228 R232 = R1210_49R9_1%_0.5W_100PPM_VISHAY_CRCW: Resistor - 1%; Part Description: Thick Film Chip Resistor; Manufacturer: VISHAY DRALORIC; Manufacturer Part Number: CRCW121049R9FKTA; Power: 0.5W; TC: ±100ppm/°C; Part Number: R1210_49R9_1%_0.5W_100PPM_VISHAY_CRCW; Component Kind: Standard; Component Type: Standard; Pin Count: 2; Value: 49R9; Status: None; Tolerance: ±1%; Case: 1210; Mounted: Yes; Sense: No; Socket: No; SMD: Yes; ComponentHeight: 0.6mm; HelpURL: \\cern.ch\dfs\Applications\Altium\Datasheets\R1210_VISHAY_CRCW1210.pdf; Author: CERN DEM JMW; CreateDate: 06.08.2014; LatestRevisionDate: 06.08.2014
R231 = R0603_270K_1%_0.1W_100PPM: Resistor - 1%; Part Description: General Purpose Thick Film Chip Resistor; Manufacturer: GENERIC; Manufacturer1 Part Number: NRC06F2703TRF; Power: 0.1W; TC: ±100ppm/°C; Part Number: R0603_270K_1%_0.1W_100PPM; Component Kind: Standard; Component Type: Standard; Pin Count: 2; Value: 270k; Status: Preferred; Tolerance: ±1%; Manufacturer Part Number: R0603_270K_1%_0.1W_100PPM; Case: 0603; Mounted: Yes; Sense: No; Socket: No; SMD: Yes; Manufacturer1 Example: NIC COMPONENT; Manufacturer1 ComponentHeight: 0.55mm; HelpURL: \\cern.ch\dfs\Applications\Altium\Datasheets\R0603_NIC_NRC.pdf; Author: CERN DEM JLC; CreateDate: 03.12.2007; LatestRevisionDate: 13.03.2008
R237 = R0603_82K_1%_0.1W_100PPM: Resistor - 1%; Part Description: General Purpose Thick Film Chip Resistor; Manufacturer: GENERIC; Manufacturer1 Part Number: NRC06F8202TRF; Power: 0.1W; TC: ±100ppm/°C; Part Number: R0603_82K_1%_0.1W_100PPM; Component Kind: Standard; Component Type: Standard; Pin Count: 2; Value: 82k; Status: Preferred; Tolerance: ±1%; Manufacturer Part Number: R0603_82K_1%_0.1W_100PPM; Case: 0603; Mounted: Yes; Sense: No; Socket: No; SMD: Yes; Manufacturer1 Example: NIC COMPONENT; Manufacturer1 ComponentHeight: 0.55mm; HelpURL: \\cern.ch\dfs\Applications\Altium\Datasheets\R0603_NIC_NRC.pdf; Author: CERN DEM JLC; CreateDate: 03.12.2007; LatestRevisionDate: 13.03.2008
SW2 SW3 = SW_OMRON_A6S-4102-H: 4 Ways SPST DIP Switch; Part Description: 4 Ways SPST DIP Switch, White Flat Actuator with Seal Tape, Contact Rating 25mA 24VDC; Manufacturer: OMRON; PressFit: No; Part Number: SW_OMRON_A6S-4102-H; Component Kind: Standard; Component Type: Standard; Pin Count: 8; PackageDescription: Pitch 2.54mm, Body 11.3x6.4mm, 4 Ways SPST Surface-Mounting DIP Switch, OMRON A6S-H; Family: Switch; Mounted: Yes; Socket: No; SMD: Yes; Sense: No; Status: None; Manufacturer Part Number: A6S-4102-H; ComponentHeight: 3.8mm; HelpURL: \\cern.ch\dfs\Applications\Altium\Datasheets\SW_OMRON_A6S-4102-H.pdf; Author: CERN DEM JMW; CreateDate: 25.09.2008; LatestRevisionDate: 25.09.2008
SW9 = SW_OMRON_A6S-2102-H: 2 Ways SPST DIP Switch; Part Description: 2 Ways SPST DIP Switch, White Flat Actuator with Seal Tape, Contact Rating 25mA 24VDC; Manufacturer: OMRON; PressFit: No; Part Number: SW_OMRON_A6S-2102-H; Component Kind: Standard; Component Type: Standard; Pin Count: 4; PackageDescription: Pitch 2.54mm, Body 6.2x6.4mm, 2 Ways SPST Surface-Mounting DIP Switch, OMRON A6S-H; Family: Switch; Mounted: Yes; Socket: No; SMD: Yes; Sense: No; Status: None; Manufacturer Part Number: A6S-2102-H; ComponentHeight: 3.8mm; HelpURL: \\cern.ch\dfs\Applications\Altium\Datasheets\SW_OMRON_A6S-2102-H.pdf; Author: CERN DEM JMW; CreateDate: 25.09.2008; LatestRevisionDate: 25.09.2008
T10-T17 T26-T29 = BSS138LT1G: N-CHANNEL MOSFET WITH DIODE; Part Description: 50V 200mA N-Channel Enhancement Mode Field-Effect Transistor; Manufacturer: ON SEMICONDUCTOR; PressFit: No; Bonding: No; Part Number: BSS138LT1G; Component Kind: Standard; Component Type: Standard; Device: BSS138LT1G; PackageDescription: SOT23 3-Leads, Pitch 0.95mm - Body 1.4x3mm, IPC Medium Density; Manufacturer Part Number: BSS138LT1G; Pin Count: 3; Case: SOT23-3; Mounted: Yes; Socket: No; SMD: Yes; Sense: No; ComponentHeight: 1.11mm; HelpURL: \\cern.ch\dfs\Applications\Altium\Datasheets\BSS138LT1G.pdf; Author: CERN DEM JLC; CreateDate: 23.03.2009; LatestRevisionDate: 23.03.2009

## Assembly variants
SMD_DCDC: not fitted IC46 IC53